# Altium schematic sheet SunS_fixture_EGSE_LDO.SchDoc: Connectors
size A3; Author: Michał Gumiela; ProjectName: SunS
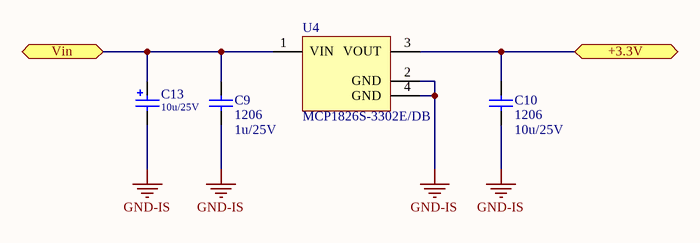
[diagram p0: SunS_fixture_EGSE_LDO.SchDoc]

## Parts
C9  Package: 1206  [SMD_Capacitor_1206]  (hidden comment: 1u/25V)
C10  Package: 1206  [SMD_Capacitor_1206]  (hidden comment: 10u/25V)
C13  10u/25V  [Tantalum_cap_D]
U4  MCP1826S-3302E/DB  [SOT-223-DB3_M]

## Ports
+3.3V, Vin

## Nets
GND-IS: C9.2 C10.2 C13.2 U4.2(GND) U4.4(GND)
+3.3V: C10.1 U4.3(VOUT) ; port +3.3V
Vin: C9.1 C13.1 U4.1(VIN) ; port Vin

## Notes on the sheet
- Title:
- Project:
- Author:
- Model:
- Document Number:
- Checked by:
- Rev:
- Date:
- Approved by:
- Sheet:
- of
- File name:

## Library data of the parts
C9 C10 = Cer_C1206T105K3RALTU: Ceramic Cap Kemet COTS 1u/25V X7R 1206; ManufacturerPartNumber: C1206T105K3RALTU; Manufacturer: Kemet
  C9: Value: 1u/25V
  C10: Value: 10u/25V
C13 = TantS_CWR11_10u_25V: Tantalum Capacitor CWR11 10u/22V.; ManufacturerPartNumber: CWR11K(6)106(1)(2)(5); Manufacturer: Kemet; Value: 10u/25V
U4 = MCP1826S-3302E/DB: 1000 mA, Low Voltage, Low Quiescent Current LDO Regulator, 3-Pin SOT-223, Extended Temperature; Manufacturer: Microchip; DatasheetVersion: revA, Aug-2007; PackageVersion: revBB, Aug-2009; PackageReference: SOT-223-DB3; PackageDescription: 3-Lead Plastic Small Outline Transistor (DB) [SOT-223]; Supplier 1: Digi-Key; Supplier Part Number 1: MCP1826S-3302E/DB-ND; Supplier 2: Newark; Supplier Part Number 2: 27M0037; Supplier 3: Mouser; Supplier Part Number 3: 579-MCP1826S-3302EDB; Mounting Technology: Surface Mount; PartNumber: MCP1826S-3302E/DB; ComponentLink1Description: Manufacturer URL; ComponentLink1URL: http://www.microchip.com/; ComponentLink2Description: Datasheet; ComponentLink2URL: http://ww1.microchip.com/downloads/en/DeviceDoc/22057a.pdf; ComponentLink3Description: Package Specification; ComponentLink3URL: http://www.microchip.com/stellent/groups/techpub_sg/documents/packagingspec/en012702.pdf